# Altium schematic sheet MCU PIC SAMPLE.SchDoc
size 209 x 297 mm; Scale: 1:1; Letter1Column: Э
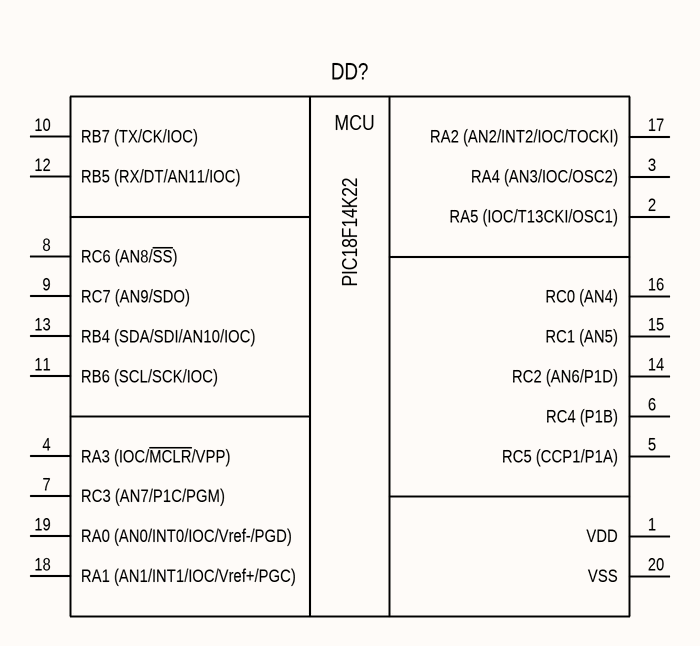
[diagram p0: MCU PIC SAMPLE.SchDoc]

## Parts
DD?  PIC18F14K22  [SOIC-20]

## Nets

Not connected (* = marked no-connect by the designer): DD? 1(VDD) 2(RA5_(IOC/T13CKI/OSC1)) 3(RA4_(AN3/IOC/OSC2)) 4(RA3_(IOC/~{MCLR}/VPP)) 5(RC5_(CCP1/P1A)) 6(RC4_(P1B)) 7(RC3_(AN7/P1C/PGM)) 8(RC6_(AN8/~{SS})) 9(RC7_(AN9/SDO)) 10(RB7_(TX/CK/IOC)) 11(RB6_(SCL/SCK/IOC)) 12(RB5_(RX/DT/AN11/IOC)) 13(RB4_(SDA/SDI/AN10/IOC)) 14(RC2_(AN6/P1D)) 15(RC1_(AN5)) 16(RC0_(AN4)) 17(RA2_(AN2/INT2/IOC/TOCKI)) 18(RA1_(AN1/INT1/IOC/Vref+/PGC)) 19(RA0_(AN0/INT0/IOC/Vref-/PGD)) 20(VSS)

## Notes on the sheet
- Перв. примен.
- Справ. №
- Подп. и дата
- Инв. № дубл.
- Взам. инв. №
- Разраб.
- Изм.
- Лист
- № докум.
- Подп.
- Дата
- Лит.
- Масса
- Масштаб
- Пров.
- Т.контр.
- Листов
- Инв. № подл.
- Утв.
- Н.контр.
- 2.106-A4
- Копировал
- Формат А4
- (in symbol PIC18F14K22) MCU

## Library data of the parts
DD? = PIC18F14K22: MCU PIC; Manufacturer: Microchip Technology; Group: Digital - MCU; Core Size: 8 Bit; Speed: 64MHz; Connectivity: USART, SPI, I2C; Number of I/O: 17; Program Memory Size: 16KB; RAM Size: 512B; Voltage Supply: 2.3V - 5.5V; Data Converters: ADC10x12, DAC5, ACx2; EEPROM Size: 256B; Clock sources: TC16x3, TC8,; Package: SOIC-20; Part name: PIC18F14K22; Operating Temperature: -40°C +85°C; Thickness: 2.65mm; Dimension: 10.30mm x 12.80mm; Core Processor: PIC; Mounting Type: Surface Mount